# EAGLE design Smart Garden (EAGLE 9.5.1)
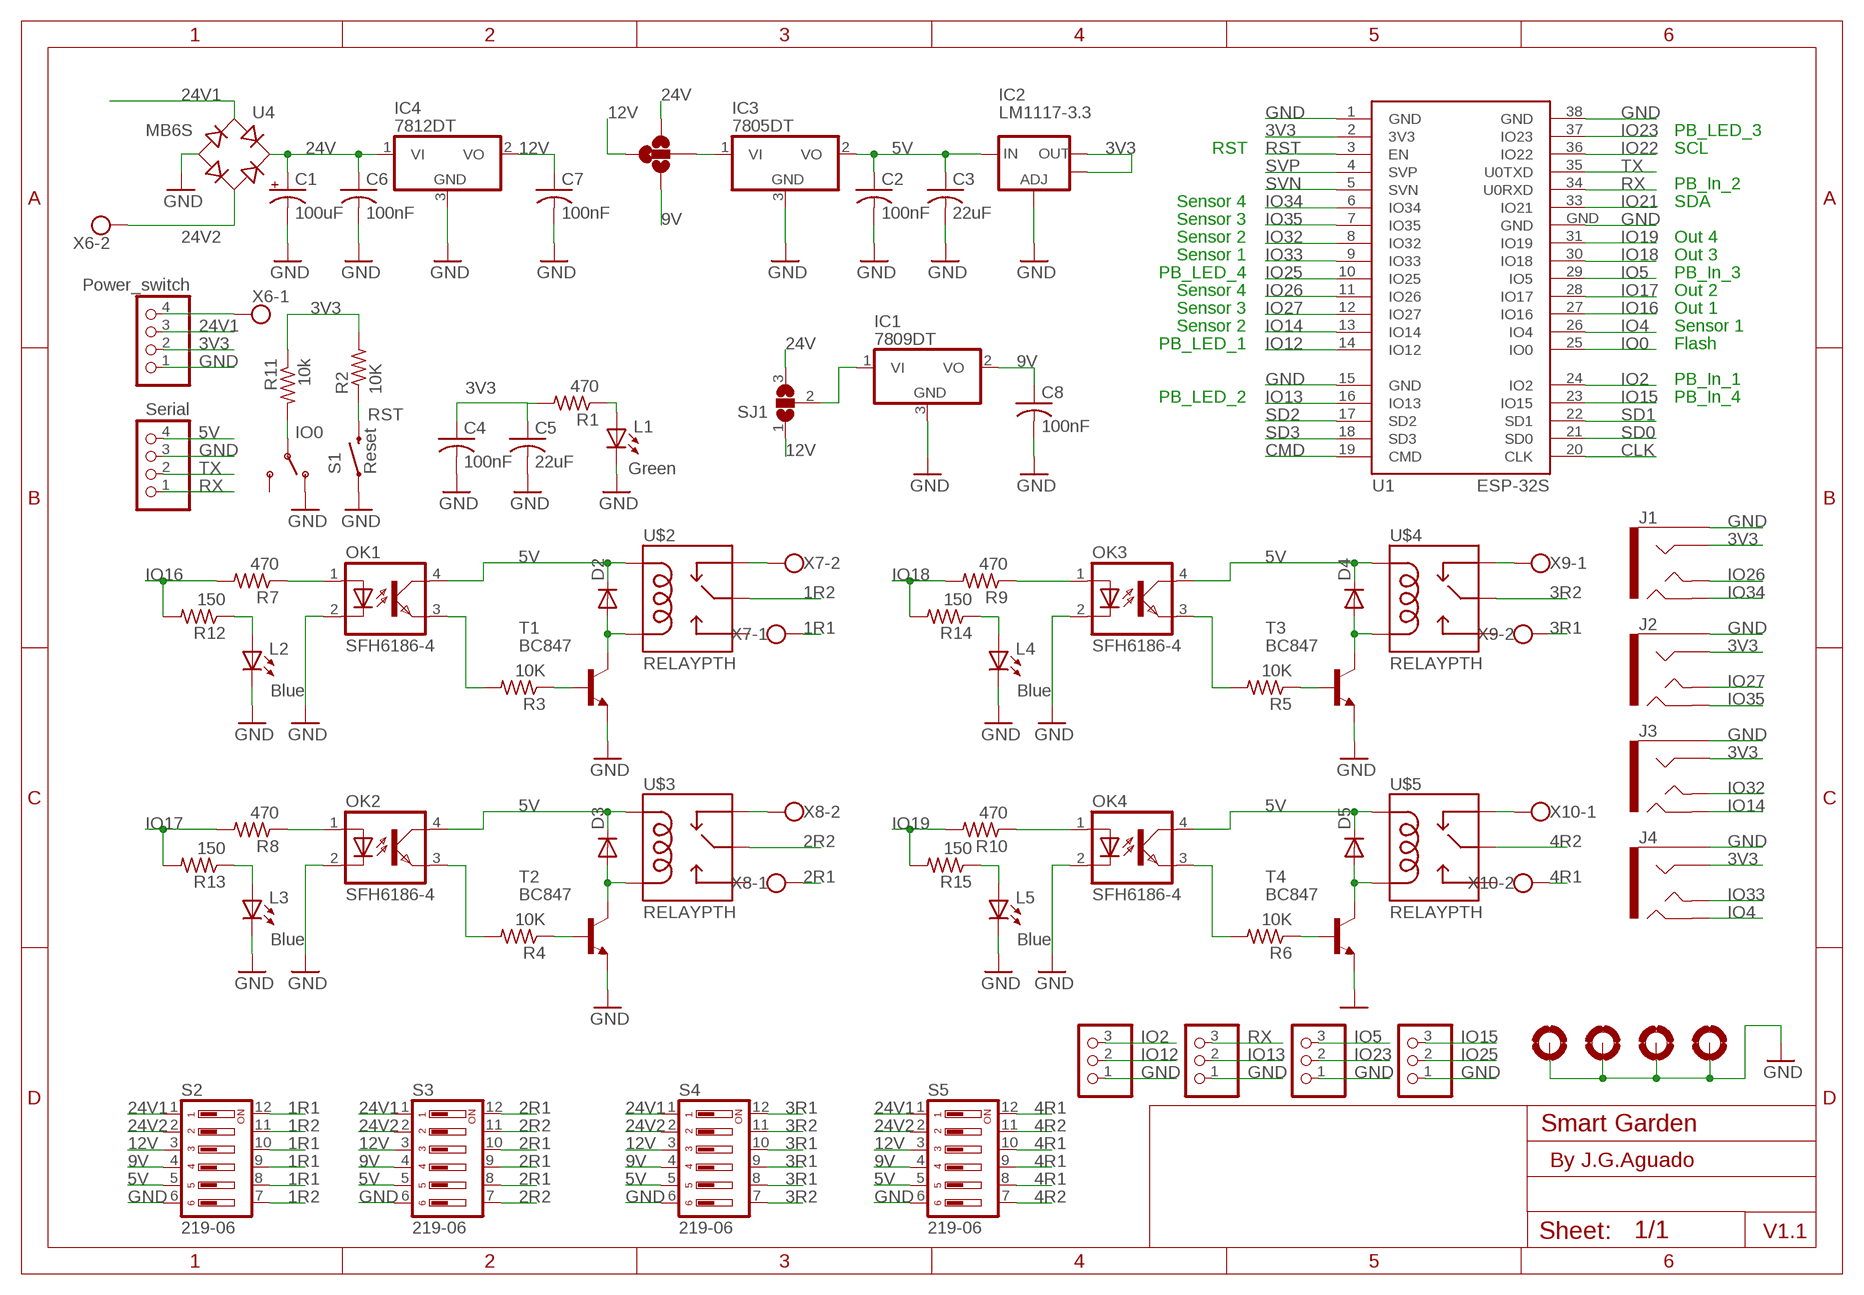
[diagram p0: schematic, sheet 1]

## Parts
C1  100uF  CPOL-USD/7343-31R  [D/7343-31R]
C2  100nF  C1206  [1206]
C3  22uF  C1206  [1206]
C4  100nF  C1206  [1206]
C5  22uF  C1206  [1206]
C6  100nF  C1206  [1206]
C7  100nF  C1206  [1206]
C8  100nF  C1206  [1206]
D2  DIODE-SOD123  [SOD123]
D3  DIODE-SOD123  [SOD123]
D4  DIODE-SOD123  [SOD123]
D5  DIODE-SOD123  [SOD123]
H1  MOUNT-PAD-ROUND3.0  [3,0-PAD]
H2  MOUNT-PAD-ROUND3.0  [3,0-PAD]
H3  MOUNT-PAD-ROUND3.0  [3,0-PAD]
H4  MOUNT-PAD-ROUND3.0  [3,0-PAD]
IC1  7809DT  7805DT  [TO252]
IC2  LM1117-3.3  V_REG_LM1117SOT223  [SOT223]
IC3  7805DT  [TO252]
IC4  7812DT  [TO252]
J1  AUDIO_JACK_TRRSSMD_RA  [AUDIO_JACK_3.5MM_TRRS_SMD_RA]
J2  AUDIO_JACK_TRRSSMD_RA  [AUDIO_JACK_3.5MM_TRRS_SMD_RA]
J3  AUDIO_JACK_TRRSSMD_RA  [AUDIO_JACK_3.5MM_TRRS_SMD_RA]
J4  AUDIO_JACK_TRRSSMD_RA  [AUDIO_JACK_3.5MM_TRRS_SMD_RA]
JP1  Serial  PINHD-1X4  [1X04]
JP2  PINHD-1X3  [1X03]
JP3  PINHD-1X3  [1X03]
JP4  PINHD-1X3  [1X03]
JP5  PINHD-1X3  [1X03]
JP6  Power_switch  PINHD-1X4  [1X04]
L1  Green  LED1206  [LED1206]
L2  Blue  LED1206  [LED1206]
L3  Blue  LED1206  [LED1206]
L4  Blue  LED1206  [LED1206]
L5  Blue  LED1206  [LED1206]
OK1  SFH6186-4  [SMD4-7]
OK2  SFH6186-4  [SMD4-7]
OK3  SFH6186-4  [SMD4-7]
OK4  SFH6186-4  [SMD4-7]
R1  470  R1206  [1206]
R2  10K  R-US_R1206  [R1206]
R3  10K  R-US_R1206  [R1206]
R4  10K  R-US_R1206  [R1206]
R5  10K  R-US_R1206  [R1206]
R6  10K  R-US_R1206  [R1206]
R7  470  R-US_R1206  [R1206]
R8  470  R-US_R1206  [R1206]
R9  470  R-US_R1206  [R1206]
R10  470  R-US_R1206  [R1206]
R11  10k  R1206  [1206]
R12  150  R1206  [1206]
R13  150  R1206  [1206]
R14  150  R1206  [1206]
R15  150  R1206  [1206]
S1  Reset  SWITCH-MOMENTARY-2SMD-4  [TACTILE_SWITCH_TALL]
S2  219-06  [CTS-219-06]
S3  219-06  [CTS-219-06]
S4  219-06  [CTS-219-06]
S5  219-06  [CTS-219-06]
SJ1  SJ2W  [SJ_2]
SJ2  SJ3W  [SJ_3_R]
T1  BC847  [SOT23]
T2  BC847  [SOT23]
T3  BC847  [SOT23]
T4  BC847  [SOT23]
U1  ESP-32S  [ESP-32S]
U4  MB6S  [SOIC-4]
U$2  RELAYPTH  [SRD-05VDC-SL-C]
U$3  RELAYPTH  [SRD-05VDC-SL-C]
U$4  RELAYPTH  [SRD-05VDC-SL-C]
U$5  RELAYPTH  [SRD-05VDC-SL-C]
U$6  SWITCH_SPDT  [KPS-1290]
X6  W237-102  [W237-102]
X7  W237-102  [W237-102]
X8  W237-102  [W237-102]
X9  W237-102  [W237-102]
X10  W237-102  [W237-102]

## Nets
1R1: S2.8 S2.9 S2.10 S2.12 X7.1
1R2: S2.7 S2.11 U$2.SWCOMMON
2R1: S3.8 S3.9 S3.10 S3.12 X8.1
2R2: S3.7 S3.11 U$3.SWCOMMON
3R1: S4.8 S4.9 S4.10 S4.12 X9.2
3R2: S4.7 S4.11 U$4.SWCOMMON
3V3: C4.1 C5.1 IC2.2(OUT) IC2.4(OUT) J1.RING1 J2.RING1 J3.RING1 J4.RING1 JP6.2 R1.2 R2.2 R11.1 U1.2(3V3)
4R1: S5.8 S5.9 S5.10 S5.12 X10.2
4R2: S5.7 S5.11 U$5.SWCOMMON
5V: C2.1 C3.1 D2.C D3.C D4.C D5.C IC2.3(IN) IC3.2(VO) JP1.4 OK1.4(COL) OK2.4(COL) OK3.4(COL) OK4.4(COL) S2.5 S3.5 S4.5 S5.5 U$2.COIL1 U$3.COIL1 U$4.COIL1 U$5.COIL1
9V: C8.1 IC1.2(VO) S2.4 S3.4 S4.4 S5.4 SJ2.P$2
12V: C7.1 IC4.2(VO) S2.3 S3.3 S4.3 S5.3 SJ1.1 SJ2.P$4
24V: C1.+ C6.1 IC4.1(VI) SJ1.3 SJ2.P$3 U4.+
24V1: JP6.3 S2.1 S3.1 S4.1 S5.1 U4.~1(AC1)
24V2: S2.2 S3.2 S4.2 S5.2 U4.~2(AC2) X6.2
CLK: U1.20(CLK)
CMD: U1.19(CMD)
GND: C1.- C2.2 C3.2 C4.2 C5.2 C6.2 C7.2 C8.2 H1.B3,0(MOUNT) H2.B3,0(MOUNT) H3.B3,0(MOUNT) H4.B3,0(MOUNT) IC1.3(GND) IC2.1(ADJ) IC3.3(GND) IC4.3(GND) J1.EARTH J2.EARTH J3.EARTH J4.EARTH JP1.3 JP2.1 JP3.1 JP4.1 JP5.1 JP6.1 L1.C L2.C L3.C L4.C L5.C OK1.2(C) OK2.2(C) OK3.2(C) OK4.2(C) S1.A2 S2.6 S3.6 S4.6 S5.6 T1.2(E) T2.2(E) T3.2(E) T4.2(E) U1.1(GND) U1.15(GND) U1.38(GND) U1.GND U4.- U$6.O
IO0: R11.2 U1.25(IO0) U$6.P
IO2: JP2.3 U1.24(IO2)
IO4: J4.RING2 U1.26(IO4)
IO5: JP4.3 U1.29(IO5)
IO12: JP2.2 U1.14(IO12)
IO13: JP3.2 U1.16(IO13)
IO14: J3.RING2 U1.13(IO14)
IO15: JP5.3 U1.23(IO15)
IO16: R7.2 R12.2 U1.27(IO16)
IO17: R8.2 R13.2 U1.28(IO17)
IO18: R9.2 R14.2 U1.30(IO18)
IO19: R10.2 R15.2 U1.31(IO19)
IO21: U1.33(IO21)
IO22: U1.36(IO22)
IO23: JP4.2 U1.37(IO23)
IO25: JP5.2 U1.10(IO25)
IO26: J1.TIP U1.11(IO26)
IO27: J2.TIP U1.12(IO27)
IO32: J3.TIP U1.8(IO32)
IO33: J4.TIP U1.9(IO33)
IO34: J1.RING2 U1.6(IO34)
IO35: J2.RING2 U1.7(IO35)
N$1: U$3.SWCLOSED(SWCLOSE) X8.2
N$2: U$2.SWCLOSED(SWCLOSE) X7.2
N$3: L1.A R1.1
N$4: U$4.SWCLOSED(SWCLOSE) X9.1
N$5: U$5.SWCLOSED(SWCLOSE) X10.1
N$6: JP6.4 X6.1
N$7: D2.A T1.3(C) U$2.COIL0
N$8: OK1.3(EMIT) R3.2
N$9: R3.1 T1.1(B)
N$11: D3.A T2.3(C) U$3.COIL0
N$12: OK2.3(EMIT) R4.2
N$13: R4.1 T2.1(B)
N$15: D4.A T3.3(C) U$4.COIL0
N$16: OK3.3(EMIT) R5.2
N$17: R5.1 T3.1(B)
N$19: D5.A T4.3(C) U$5.COIL0
N$20: OK4.3(EMIT) R6.2
N$21: R6.1 T4.1(B)
N$22: OK1.1(A) R7.1
N$23: L2.A R12.1
N$24: L3.A R13.1
N$25: OK2.1(A) R8.1
N$26: L4.A R14.1
N$27: OK3.1(A) R9.1
N$28: L5.A R15.1
N$29: OK4.1(A) R10.1
N$30: IC1.1(VI) SJ1.2
N$32: IC3.1(VI) SJ2.P$1
RST: R2.1 S1.B2 U1.3(EN)
RX: JP1.1 JP3.3 U1.34(U0RXD)
SD0: U1.21(SD0)
SD1: U1.22(SD1)
SD2: U1.17(SD2)
SD3: U1.18(SD3)
SVN: U1.5(SVN)
SVP: U1.4(SVP)
TX: JP1.2 U1.35(U0TXD)
Unconnected: U$2.SWOPEN U$3.SWOPEN U$4.SWOPEN U$5.SWOPEN U$6.S

## Notes on the sheet
- PB_LED_3
- RST | SCL
- PB_In_2
- Sensor 4 | SDA
- Sensor 3
- Sensor 2 | Out 4
- Sensor 1 | Out 3
- PB_LED_4 | PB_In_3
- Sensor 4 | Out 2
- Sensor 3 | Out 1
- Sensor 2 | Sensor 1
- PB_LED_1 | Flash
- PB_In_1
- PB_LED_2 | PB_In_4
- By J.G.Aguado
- V1.1

## Library data of the parts
C1 = rcl:CPOL-US: POLARIZED CAPACITOR, American symbol; SPICEPREFIX: C
C2-C8 = SpaceDIY_passive_components:C1206
D2-D5 = diode:DIODE-: DIODE
H1-H4 = holes:MOUNT-PAD-ROUND: MOUNTING PAD, round
IC1 IC3 = linear:78*: Positive VOLTAGE REGULATOR Source: http://cache.national.com/ds/LM/LM78L05.pdf http://www.fairchildsemi.com/ds/LM/LM7805.pdf
IC2 = SparkFun:V_REG_LM1117: Voltage Regulator LM1117 Standard adjustable voltage regulator but in SMD form. Spark Fun Electronics SKU : COM-00595
IC4 = adafruit:78*: Positive VOLTAGE REGULATOR Added bigger pads to the TO-92 package
J1-J4 = SparkFun-Connectors:AUDIO_JACK_TRRS: Audio Jack - 3.5mm TRRS (SMD) This is a 3.5mm TRRS SMD audio jack. TRRS connectors are the audio-style connectors that you see on some phones, MP3 players and development boards. TRRS stands for “tip, ring, ring, sleeve,” which reflects that this has three conductors and a ground. SparkFun Products: Audio Jack <https://www.sparkfun.com/products/12639> mbed Starter Kit <https://www.sparkfun.com/products/12968> SparkFun TRRS 3.5mm Jack Breakout <https://www.sparkfun.com/products/11570>; PROD_ID: CONN-10676; SF_ID: PRT-12639
JP1 JP6 = SpaceDIY_connectors:PINHD-1X4: PIN HEADER
JP2-JP5 = adafruit:PINHD-1X3: PIN HEADER
L1-L5 = SpaceDIY_passive_components:LED1206
OK1-OK4 = optocoupler:SFH618?*: Optocoupler, Phototransistor Output, Low Input Current Source: Data sheet <http://www.vishay.com/docs/83673/sfh618.pdf>; MF: VISHAY/TELEFUNKEN; MPN: SFH6186-4; OC_FARNELL: 1469530; OC_NEWARK: 21H7753
R1 R11-R15 = SpaceDIY_passive_components:R1206
R2-R10 = resistor:R-US_: RESISTOR, American symbol
S1 = Testing:SWITCH-MOMENTARY-2: Various NO switches- pushbuttons, reed, etc
S2-S5 = switch-dil:219-06*: Surface Mount DIP Switch Series 219 SMT CTS Electronic Components Sourc: www.ctscorp.com; OC_FARNELL: unknown; OC_NEWARK: unknown
SJ1 = jumper:SJ2W: SMD solder JUMPER
SJ2 = SpaceDIY_connectors:SJ3W: SMD solder JUMPER
T1-T4 = transistor:BC847: NPN TRANSISTOR
U1 = esp32:ESP-32S: Ai-Thinker ESP-32S
U4 = rectifier:MB*S: Bridge Rectifier Source: http://www.fairchildsemi.com/ds/MB/MB6S.pdf
U$2-U$5 = SpaceDIY_actuators:RELAY: SPDT relay (COM-00101)
U$6 = SparkFun-Retired:SWITCH_SPDT: SWCH-10651 Side-actuated SPDT slide switch, as used on the Arduino Pro; PROD_ID: SWCH-10651
X6-X10 = con-wago-500:W237-102: WAGO SCREW CLAMP; MPN: 237-102; OC_FARNELL: unknown; OC_NEWARK: 70K9898

## Board
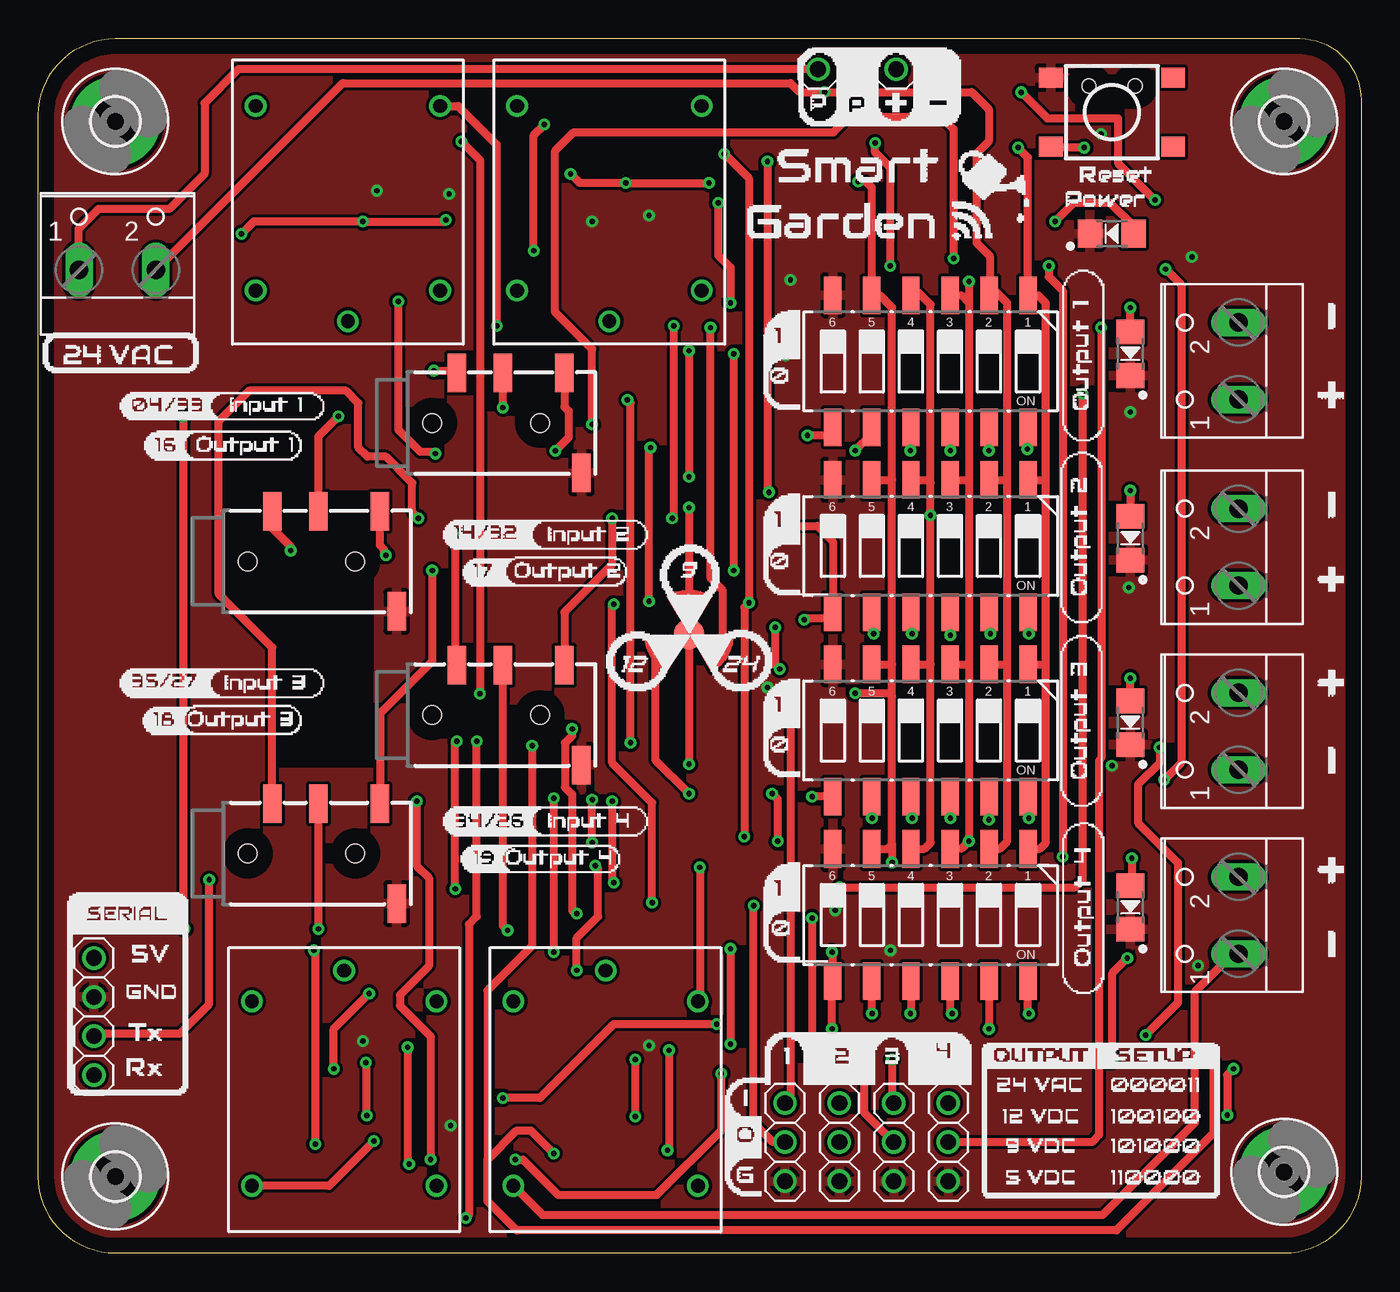
[diagram p1: board, top side]
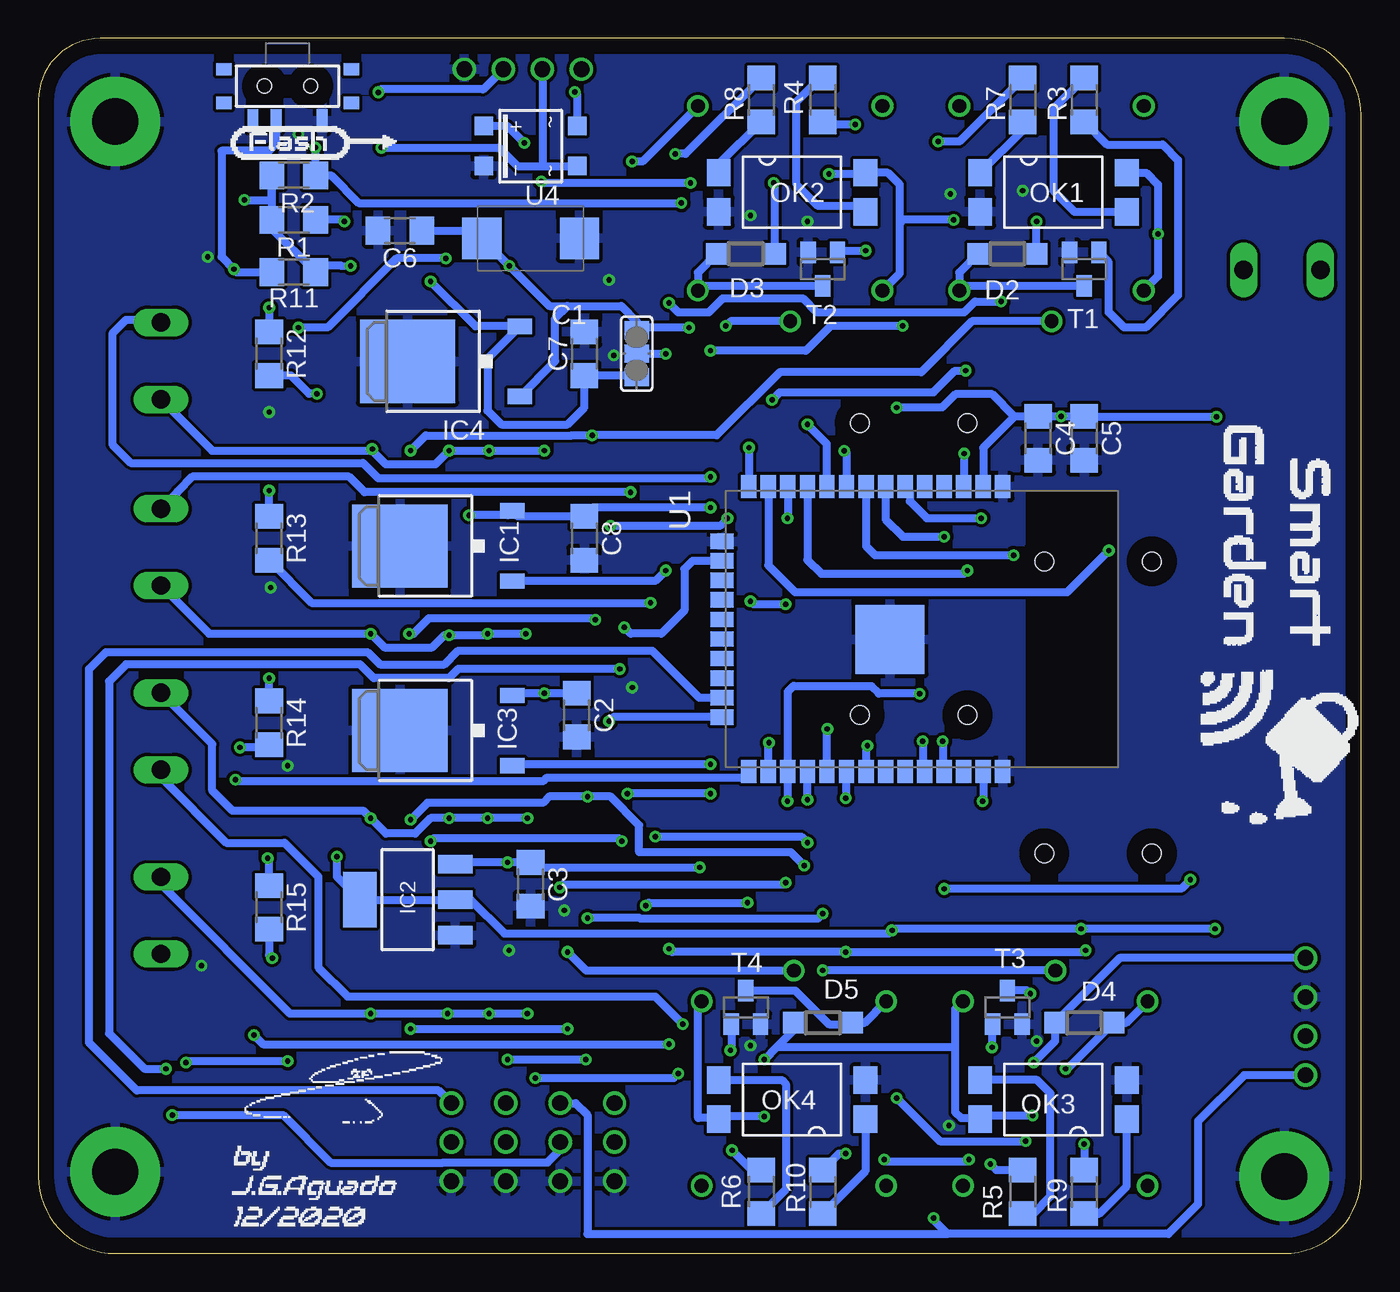
[diagram p2: board, bottom side, seen from below]

Size 86 x 79 mm. Coordinates in mm from the lower left corner, seen from the top.
Outline: 0,5 0,74 arc-90 5,79 82,79 arc-90 86,75 86,5 arc-90 81,0 5,0 arc-90 0,5
Copper layers (1*16): Top 0.035mm / dielectric 1.5mm / Bottom 0.035mm
Design rules "PCBway": minimum track width 6mil, minimum drill 0.3mm, track to track 0.205mm, track to pad 0.205mm, pad to pad 0.205mm, via to via 0.205mm, smd to smd 8mil, copper to edge 40mil, drill to drill 8mil, minimum pad ring 10mil, minimum via ring 8mil, stop-mask expansion 4mil, vias tented up to drill 25mil, thermal gap 10mil

### Footprints (pad centres in the part's own frame; a part is rotated, then mirrored left to right if it is on the bottom)
D/7343-31R = smd 2.55 x 2.7: + 3.175,0; - -3.175,0
1206 = smd 1.6 x 1.803: 1 -1.422,0; 2 1.422,0
SOD123 = smd 1.4 x 1.4: A 1.9,0; C -1.9,0
3,0-PAD = drill 3 pad 5.842: B3,0 0,0
TO252 = smd 1 x 1.6: 1 -2.28,-4.8; 2 2.28,-4.8 | smd 5.4 x 6.2: 3 0,2.5
SOT223 = smd 1.219 x 2.235: 1 -2.311,-3.099; 2 0,-3.099; 3 2.311,-3.099 | smd 3.6 x 2.2: 4 0,3.099
AUDIO_JACK_3.5MM_TRRS_SMD_RA = smd 1.2 x 2.5: EARTH 11.3,-3.25; RING1 6.2,3.25; RING2 3.2,3.25; TIP 10.2,3.25 | hole 1.2: 1.6,0; 8.6,0
1X04 = drill 1.016: 1 -3.81,0; 2 -1.27,0; 3 1.27,0; 4 3.81,0
1X03 = drill 1.016: 1 -2.54,0; 2 0,0; 3 2.54,0
LED1206 = smd 1.6 x 1.803: A -1.422,0; C 1.422,0
SMD4-7 = smd 1.78 x 1.55: 1 -1.27,-4.77; 2 1.27,-4.77; 3 1.27,4.77; 4 -1.27,4.77
R1206 = smd 1.6 x 1.803: 1 -1.422,0; 2 1.422,0
TACTILE_SWITCH_TALL = smd 1.55 x 1.3: A1 -3.975,-2.25; A2 3.975,-2.25; B1 -3.975,2.25; B2 3.975,2.25
CTS-219-06 = smd 1.13 x 2.44: 1 -6.35,-4.3; 2 -3.81,-4.3; 3 -1.27,-4.3; 4 1.27,-4.3; 5 3.81,-4.3; 6 6.35,-4.3; 7 6.35,4.3; 8 3.81,4.3; 9 1.27,4.3; 10 -1.27,4.3; 11 -3.81,4.3; 12 -6.35,4.3
SJ_2 = smd 1.168 x 1.6: 1 -1.524,0; 2 0,0; 3 1.524,0
SJ_3_R = smd 2 x 2: P$1 0,0 | smd 0.254 x 0.254: P$2 0,2.54; P$3 2.2,-1.27; P$4 -2.2,-1.27
SOT23 = smd 1 x 1.4: 1 -0.95,-1.1; 2 0.95,-1.1; 3 0,1.1
ESP-32S = smd 1.5 x 1: 1 -9.25,7; 2 -9.25,5.73; 3 -9.25,4.46; 4 -9.25,3.19; 5 -9.25,1.92; 6 -9.25,0.65; 7 -9.25,-0.62; 8 -9.25,-1.89; 9 -9.25,-3.16; 10 -9.25,-4.43; 11 -9.25,-5.7; 12 -9.25,-6.97; 13 -9.25,-8.24; 14 -9.25,-9.51; 25 9.25,-9.51; 26 9.25,-8.24; 27 9.25,-6.97; 28 9.25,-5.7; 29 9.25,-4.43; 30 9.25,-3.16; 31 9.25,-1.89; 32 9.25,-0.62; 33 9.25,0.65; 34 9.25,1.92; 35 9.25,3.19; 36 9.25,4.46; 37 9.25,5.73; 38 9.25,7 | smd 1 x 1.5: 15 -5.7,-11.25; 16 -4.43,-11.25; 17 -3.16,-11.25; 18 -1.89,-11.25; 19 -0.62,-11.25; 20 0.65,-11.25; 21 1.92,-11.25; 22 3.19,-11.25; 23 4.46,-11.25; 24 5.73,-11.25 | smd 4.5 x 4.5: GND 0.68,-0.33
SOIC-4 = smd 1.2 x 1.2: + 1.3,3.05; - -1.3,3.05; ~1 -1.3,-3.05; ~2 1.3,-3.05
SRD-05VDC-SL-C = drill 0.9: COIL0 -5.39,-6.12; COIL1 -5.39,5.88; SWCLOSED 6.61,-6.12; SWCOMMON -7.39,-0.12; SWOPEN 6.61,5.88
KPS-1290 = smd 0.7 x 1.5: O -2.25,2.25; P 0.75,2.25; S 2.25,2.25 | smd 1 x 0.8: P$1 -4.15,1.1; P$2 -4.15,-1.1; P$3 4.15,-1.1; P$4 4.15,1.1 | hole 0.9: -1.5,0; 1.5,0
W237-102 = drill 1.194 long: 1 -2.5,-1.27; 2 2.5,-1.27

### Placement (x,y rotation side)
C1  54,66 180 bottom
C2  51,35 270 bottom
C3  54,24 270 bottom
C4  21,53 270 bottom
C5  18,53 270 bottom
C6  62.5,66.5 180 bottom
C7  50.5,58.5 90 bottom
C8  50.5,46.5 270 bottom
D2  23,65 180 bottom
D3  40,65 180 bottom
D4  18,15 0 bottom
D5  35,15 0 bottom
H1  5,5 0 top
H2  81,5.3 0 top
H3  5,73.6 0 top
H4  81,73.6 0 top
IC1  60,46 90 bottom
IC2  62,23 90 bottom
IC3  60,34 90 bottom
IC4  59.5,58 90 bottom
J1  12,26 0 top
J2  24,35 0 top
J3  12,45 0 top
J4  24,54 0 top
JP1  3.6,15.4 90 top
JP2  48.54,7.23 90 top
JP3  52.08,7.23 90 top
JP4  55.62,7.23 90 top
JP5  59.16,7.23 90 top
JP6  54.5,77 180 top
L1  69.8,66.3 180 top
L2  71,58.5 270 top
L3  71,46.5 270 top
L4  71,34.5 270 top
L5  71,22.5 270 top
OK1  20,69 270 bottom
OK2  37,69 270 bottom
OK3  20,10 90 bottom
OK4  37,10 90 bottom
R1  69.4,67.2 180 bottom
R2  69.4,70.1 180 bottom
R3  18,75 90 bottom
R4  35,75 90 bottom
R5  22,4 270 bottom
R6  39,4 270 bottom
R7  22,75 90 bottom
R8  39,75 90 bottom
R9  18,4 90 bottom
R10  35,4 90 bottom
R11  69.4,63.8 180 bottom
R12  71,58.5 270 bottom
R13  71,46.5 270 bottom
R14  71,34.5 270 bottom
R15  71,22.5 270 bottom
S1  69.8,74.2 180 top
S2  58,58 180 top
S3  58,46 180 top
S4  58,34 180 top
S5  58,22 180 top
SJ1  47.1,58.5 90 bottom
SJ2  42.3,40.26 0 top
T1  18,64 180 bottom
T2  35,64 180 bottom
T3  23,16 0 bottom
T4  40,16 0 bottom
U1  30.3,40.6 270 bottom
U4  54,72 90 bottom
U$2  20,68 90 top
U$3  37,68 90 top
U$4  20,11 270 top
U$5  37,11 270 top
U$6  69.8,75.9 180 bottom
X6  5.14,65.22 0 top
X7  76.76,58.03 90 top
X8  76.76,45.92 90 top
X9  76.76,33.95 90 top
X10  76.76,21.98 90 top

### Tracks (layer width: path | path; a pad name or v marks a point on that pad's centre or on a via)
1R1  (via drill 0.35)
  Top 0.508: v53.1,52.2 54.19,53.29 S2.8 | S2.9 56.73,52.23 v56.7,52.2 | S2.10 59.3,53.67 v59.3,52.2 | v64.3,52.3 64.3,53.65 S2.12
  Bottom 0.508: X7.1 74.7,52.2 64.3,52.2 | v53.1,52.2 v56.7,52.2 v59.3,52.2 60.2,51.3 63.4,51.3 64.3,52.2 | 64.3,52.2 v64.3,52.3
1R2  (via drill 0.35)
  Top 0.508: S2.11 v61.81,52.21 v61.8,52.2 | v50,53.2 51.15,53.2 S2.7
  Bottom 0.508: v61.8,52.2 60.81,53.19 51.3,53.19 51.29,53.2 v50,53.2 41.9,53.2 37.8,57.3 28.6,57.3 25.29,60.61 U$2.SWCOMMON
2R1  (via drill 0.35)
  Top 0.508: S3.12 64.35,40.35 v64.4,40.3 | v54.3,40.3 54.19,40.41 S3.8 | S3.9 56.73,40.37 v56.8,40.3 | S3.10 59.27,40.23 v59.3,40.2
  Bottom 0.508: v54.3,40.3 v56.8,40.3 56.9,40.2 v59.3,40.2 59.6,40.2 60.4,39.4 63.5,39.4 v64.4,40.3 74.91,40.3 X8.1
2R2  (via drill 0.35)
  Top 0.508: v41.3,60.3 41.3,47.9 v41.2,47.8 | v48.8,47.3 50.65,47.3 51.65,46.3 S3.7 51.65,41.65 51.3,41.3 49.9,41.3 v49.8,41.2 | S3.11 61.81,40.39 v61.9,40.3
  Bottom 0.508: U$3.SWCOMMON 40.99,60.61 v41.3,60.3 | v41.2,47.8 41.7,47.3 v48.8,47.3 | v61.9,40.3 61.6,40.3 60.6,41.3 49.9,41.3 v49.8,41.2
3R1  (via drill 0.35)
  Top 0.508: S4.8 v54.19,28.31 v54.2,28.3 | v64.4,28.3 64.4,29.65 S4.12 | S4.9 56.73,28.37 v56.8,28.3 | S4.10 59.27,28.33 v59.3,28.3
  Bottom 0.508: v54.2,28.3 v56.8,28.3 v59.3,28.3 60.5,28.3 61.5,27.3 63.4,27.3 v64.4,28.3 64.9,28.8 73.4,28.8 74.7,30.1 74.7,33.12 X9.2
3R2  (via drill 0.35)
  Top 0.508: S4.7 v50.3,29.7 | v61.8,28.2 S4.11 | v35,18.4 35,20.5 36.4,21.9 36.4,25 v36.2,25.2
  Bottom 0.508: v61.8,28.2 60.7,29.3 53.2,29.3 52.8,29.7 v50.3,29.7 48.8,29.7 46.94,27.84 46.94,26.1 37.1,26.1 v36.2,25.2 | U$4.SWCOMMON v34.99,18.39 v35,18.4
3V3  (via drill 0.35)
  Top 0.508: v65.7,64.2 65.7,63.5 66.6,62.6 v66.6,25.8 | v30.5,21 30.2,21.3 J2.RING1 | v30.2,55 J4.RING1 | v19.5,54.42 18.2,53.12 J3.RING1 | J1.RING1 v18.2,21.1 | v9.4,54.4 9.4,21.2 v9.5,21.1 | v63.9,75.5 65.6,73.8 67.7,73.8 70.2,73.8 70.2,73.3 70.2,70.9 v72.6,68.5
  Bottom 0.508: JP6.2 57.1,75.67 57.1,75.7 63.7,75.7 v63.9,75.5 | v65.7,64.2 66.29,64.21 68.39,64.21 R11.1 70.82,66.64 R1.2 R2.2 70.82,68.58 70.9,68.5 v72.6,68.5 | v66.6,25.8 66.6,24.5 IC2.4 IC2.2 57.9,23 55.7,20.8 30.7,20.8 v30.5,21 30.4,21.1 v18.2,21.1 v9.5,21.1 | 22.53,54.42 C4.1 v19.5,54.42 C5.1 9.42,54.42 v9.4,54.4 | U1.2 24.57,52.38 22.53,54.42 | v30.2,55 27.25,55 26.38,55.87 23.98,55.87 22.53,54.42
4R1  (via drill 0.35)
  Top 0.508: v64.4,15.6 64.35,15.65 S5.12 | v54.2,15.6 S5.8 | S5.9 56.73,15.63 v56.7,15.6 | S5.10 59.27,15.73 v59.4,15.6
  Bottom 0.508: X10.2 78.03,23.98 69.66,15.6 v64.4,15.6 v59.4,15.6 v56.7,15.6 v54.2,15.6
4R2  (via drill 0.35)
  Top 0.508: S5.11 v61.81,14.61 v61.8,14.6 | v51.6,14.6 51.6,17.65 S5.7 51.65,19.55 v51.6,19.6
  Bottom 0.508: v61.8,14.6 v51.6,14.6 | v51.6,19.6 50.39,18.39 U$5.SWCOMMON
5V  (via drill 0.35)
  Top 0.508: S5.5 55.2,26.3 55.5,26.6 | 55.5,26.6 55.5,36.2 | 55.5,36.2 55.5,38.3 | 55.5,38.3 55.5,50.3 | 55.5,50.3 55.5,61.5 54.7,62.3 S2.5 54.19,69.31 53.8,69.7 v53.3,69.7 | S3.5 55.5,50.3 | S4.5 55.5,38.3 | v34.6,70.2 35.2,69.6 v38.2,69.6 v43.6,69.6 | v13.2,66.3 14,67.1 v21.1,67.1 26.4,67.1 v26.5,67.2 | 55.5,26.6 v55.5,25.42 | v38.8,12.6 v38.8,8.9 | v21.3,12.4 21.3,9.1 21.4,9 v21.35,8.95 | v43,25.1 43,16.51 U$5.COIL1 | 55.5,36.2 55.28,36.42 v53.1,36.42
  Bottom 0.508: D3.C 38.1,69.5 v38.2,69.6 | v34.6,70.2 32.3,70.2 OK2.4 30.77,70.27 30,69.5 30,67 | U$3.COIL1 30,63.73 30,67 | OK1.4 13.97,70.27 13.2,69.5 v13.2,66.3 13.2,63.53 U$2.COIL1 | D2.C v21.1,67.1 | v26.5,67.2 29.8,67.2 30,67 | v43.6,69.6 53.2,69.6 v53.3,69.7 | IC2.3 58.79,25.42 v55.5,25.42 C3.1 53.68,25.1 v43,25.1 | OK4.4 41.84,8.8 | 41.84,8.8 43.1,8.8 43.1,16.17 U$5.COIL1 | D5.C 36.9,14.5 38,13.4 | v38.8,8.9 41.74,8.9 41.84,8.8 | v21.3,12.4 19.9,13.8 D4.C 15.69,19.21 JP1.4 | v21.35,8.95 24.55,8.95 OK3.4 24.84,8.8 26,8.8 26.4,9.2 26.4,13.4 | U$4.COIL1 26.4,15.87 26.4,13.4 | 26.4,13.4 38,13.4 | 38,13.4 v38.8,12.6 | C2.1 v53.1,36.42 55.06,36.42 IC3.2
9V  (via drill 0.35)
  Top 0.508: S5.4 57.6,26.3 58,26.7 58,38.3 | 58,38.3 v58,48 58,50.1 | 58,50.1 58,61.7 57.2,62.5 56.93,62.5 S2.4 | S4.4 58,38.3 | S3.4 57.8,50.3 58,50.1 | SJ2.P$2 | v42.3,48.5 SJ2.P$2
  Bottom 0.508: v58,48 55.48,48 IC1.2 54.84,47.92 C8.1 49.92,48.5 v42.3,48.5
12V  (via drill 0.35)
  Top 0.508: S2.3 60,62.3 60.5,61.8 | 60.5,61.8 60.5,50.4 | 60.5,50.4 60.5,38.3 | 60.5,38.3 v60.5,26.8 60,26.3 S5.3 | S3.3 60.4,50.3 60.5,50.4 | S4.3 60.5,38.3 | SJ2.P$4 40.1,32.1 v42.3,29.9 | v60.5,63.2 60.5,61.8 | v47.7,29.9 48.06,29.54 v48.06,26.8
  Bottom 0.508: SJ1.1 47.2,57.08 C7.1 50.5,55 51.6,53.9 55.9,53.9 56.8,54.8 56.8,58.18 IC4.2 57.58,60.28 v60.5,63.2 | v42.3,29.9 v47.7,29.9 | v48.06,26.8 48.26,27 60.3,27 v60.5,26.8
24V  (via drill 0.35)
  Top 0.508: SJ2.P$3 44.5,43.1 43.7,43.9 v43.7,60.2 | v55.39,64.21 55.39,70.61 54.4,71.6 v54.4,72.2
  Bottom 0.508: IC4.1 52.4,58.02 52.4,60.8 51.6,61.6 | 51.6,61.6 48.1,61.6 47.1,60.6 47.1,60.1 | 47.1,60.1 SJ1.3 | 51.6,61.6 52.77,61.6 v55.39,64.21 C1.+ 57.04,66.14 57.4,66.5 C6.1 | v43.7,60.2 47,60.2 47.1,60.1 | v54.4,72.2 55.5,73.3 U4.+
24V1  (via drill 0.35)
  Top 0.508: S5.1 65.1,26.3 65.5,26.7 65.5,38.3 | 65.5,38.3 65.5,50.2 | 65.5,50.2 65.5,61.8 65,62.3 S2.1 64.35,71.25 v63.7,71.9 | S3.1 65.4,50.3 65.5,50.2 | S4.1 65.5,38.3
  Bottom 0.508: v63.7,71.9 56.05,71.9 54.85,70.7 53.3,70.7 | 53.3,70.7 U4.~1 | JP6.3 53.23,70.77 53.3,70.7
24V2  (via drill 0.35)
  Top 0.508: S5.2 62.5,26.3 63,26.8 63,38.3 | 63,38.3 63,50.3 | 63,50.3 63,61.8 62.3,62.5 62.01,62.5 61.85,62.34 | 61.85,62.34 S2.2 | X6.2 19.79,76.1 48.9,76.1 49.49,75.51 v51.13,75.51 60.69,75.51 61.8,74.4 61.8,72.32 60.99,71.51 60.99,65.71 61.85,64.85 61.85,62.34 | S4.2 63,38.3 | S3.2 63,50.3
  Bottom 0.508: v51.13,75.51 50.95,75.34 U4.~2
GND  (via drill 0.35)
  Top 0.508: L5.C 71.5,20.58
  other vias: 21.1,13.8 26.8,8.3 39.7,13.5 51.8,22.3 55.4,19.7 47.4,36.8 69.8,31.7 70.9,43.3 71,54.7 75,64.8 48.9,63.3 39.7,67.5 36,67.1 26.7,68.9 22,69.1 48.6,58.4 75.4,18.7 69.1,72.8
  pour Top: 0,74 arc-90 5,79 81,79 arc-90 86,74 86,5 arc-90 81,0 5,0 arc-90 0,5
  pour Bottom: 0,74 arc-90 5,79 81,79 arc-90 86,74 86,5 arc-90 81,0 5,0 arc-90 0,5
IO0  (via drill 0.35)
  Top 0.508: v73.2,30.8 74.3,31.9 74.3,63 v73.3,64
  Bottom 0.508: R11.2 73.1,63.8 v73.3,64 74.1,64.8 74.1,71.7 71,71.7 70.55,72.15 U$6.P | U1.25 40.26,30.9 53,30.9 53.2,30.7 73.1,30.7 v73.2,30.8
IO2  (via drill 0.35)
  Top 0.508: v48.9,34.6 48.9,10.13 JP2.3
  Bottom 0.508: U1.24 48.63,34.87 v48.9,34.6
IO4  (via drill 0.35)
  Top 0.508: v38.5,33.2 38.5,55.3 v38.3,55.5 | v25.7,57.4 27.05,57.4 J4.RING2
  Bottom 0.508: U1.26 38.54,33.16 v38.5,33.2 | v38.3,55.5 37.8,56 27.8,56 26.4,57.4 v25.7,57.4
IO5  (via drill 0.35)
  Top 0.508: v34.7,34.1 34.7,33.65 34.24,33.19 34.24,30.31 34.7,29.85 34.7,22.3 34.9,22.1 v35,22.1 | v50.3,21.8 50.3,12.7 v50.4,12.6 | v55.5,12.6 55.5,9.89 JP4.3
  Bottom 0.508: U1.29 34.73,34.07 v34.7,34.1 | v50.3,21.8 46.88,21.8 46.85,21.76 35.34,21.76 v35,22.1 | v50.4,12.6 v55.5,12.6
IO12  (via drill 0.35)
  Top 0.508: JP2.2 47.77,7.23 46.5,8.5 v46.5,22.6 | v39.9,22.8 39.9,29.3 37.3,31.9 37.3,42.1 v37.4,42.2 | v39.7,42.4 39.7,52.3 v39.8,52.4
  Bottom 0.508: v46.5,22.6 46.3,22.8 v39.9,22.8 | v37.4,42.2 39.5,42.2 v39.7,42.4 | v39.8,52.4 v39.81,52.39 U1.14
IO13  (via drill 0.35)
  Top 0.508: v47.9,40.7 47.9,38.3 v48.2,38 | v77.3,9 77.3,11.6 v77.7,12
  Bottom 0.508: U1.16 43.47,45.03 44,44.5 44,41.8 45.5,40.3 47.5,40.3 v47.9,40.7 | v48.2,38 58.7,38 59.3,37.4 64.2,37.4 65.1,38.3 80.3,38.3 81.4,37.2 81.4,14.3 79.1,12 v77.7,12 | v77.3,9 70.1,9 67,5.9 59.68,5.9 59.67,5.91 52.89,5.91 52.08,6.72 JP3.2
IO14  (via drill 0.35)
  Top 0.508: J3.RING2 15.2,47.15 16.4,45.95 v16.4,45.7
  Bottom 0.508: U1.13 38.54,44.74 36.8,43 19.1,43 v16.4,45.7
IO15
  Bottom 0.508: JP5.3 59.99,10.6 79.6,10.6 82.7,13.7 82.7,38 81.6,39.1 64.6,39.1 63.8,38.3 59.6,38.3 58.7,39.2 46.1,39.2 43.04,36.14 U1.23
IO16  (via drill 0.35)
  Top 0.508: v27.5,72.3 28.7,71.1 v28.7,36.4 | v37.3,29.4 37.3,24.1 v37.4,24.1 | v67.9,55.9 67.9,24.3 67.4,23.8 v52.1,23.8
  Bottom 0.508: R7.2 26.12,72.3 v27.5,72.3 | v28.7,36.4 31.36,36.4 31.82,36.87 36.87,36.87 36.9,36.9 37.27,36.53 U1.27 37.3,31.32 v37.3,29.4 | v67.9,55.9 68.4,55.9 69.58,57.08 R12.2 | v37.4,24.1 37.5,24 51.9,24 v52.1,23.8
IO17  (via drill 0.35)
  Top 0.508: v44.6,71.5 46.2,69.9 v46.2,42.3 45.9,42 v45.9,27.1 | v36,26.7 v36,29.5
  Bottom 0.508: R8.2 43.92,71.5 v44.6,71.5 | R13.2 68.22,42.3 v46.2,42.3 | v36,29.5 U1.28 | v45.9,27.1 36.4,27.1 v36,26.7
IO18  (via drill 0.35)
  Top 0.508: v72.9,32.9 72.9,31.9 71.5,30.5 71.5,28 74.1,25.4 74.1,16.3 v72,14.2 | v33.5,29.6 v33.5,19.6 | v17.9,19.7 18,19.6 v18,7.1 | v45,19.8 v45,13.6
  Bottom 0.508: R14.2 71.18,32.9 v72.9,32.9 | v72,14.2 71.4,13.6 v45,13.6 | U1.30 33.5,31.31 v33.5,29.6 | v17.9,19.7 18,19.6 v33.5,19.6 44.8,19.6 v45,19.8 | v18,7.1 R9.2
IO19  (via drill 0.35)
  Top 0.508: v33.5,6.5 32,8 31.1,8 29.2,6.1 | v76.4,12.4 76.4,7.8 70.1,1.5 31.1,1.5 29.2,3.4 29.2,6.1 | v32.1,33.01 32.1,20 29.2,17.1 29.2,6.1 | v70.8,19.2 69.8,18.2 v69.8,12.5
  Bottom 0.508: R10.2 33.92,6.5 v33.5,6.5 | v32.1,33.01 32.19,32.92 U1.31 | R15.2 71,19.4 v70.8,19.2 | v69.8,12.5 76.3,12.5 v76.4,12.4
IO23  (via drill 0.35)
  Top 0.508: JP4.2 53.7,9.15 v53.7,11.4 | v24.6,29.4 24.6,25.2 25.4,24.4 25.4,18.7 23.5,16.8 23.5,16.1 25.5,14.1 v25.5,6.1 | v31,6.1 31.5,6.1 33.8,3.8 40.2,3.8 44.4,8 v44.4,11.7
  Bottom 0.508: v53.7,11.4 44.7,11.4 v44.4,11.7 | U1.37 24.57,29.43 v24.6,29.4 | v25.5,6.1 25.5,6 30.9,6 v31,6.1
IO25  (via drill 0.35)
  Top 0.508: v36,53.9 36,58.8 33.6,61.2 33.6,71.7 34.8,72.9 51.7,72.9 52.7,73.9 58.7,73.9 59.5,73.1 v59.5,64.7 | JP5.2 68.5,7.23 68.96,7.69 68.96,32.05 69.1,32.18 v69.1,60.2
  Bottom 0.508: U1.10 34.73,52.63 v36,53.9 | v59.5,64.7 62.7,64.7 67.2,60.2 v69.1,60.2
IO26  (via drill 0.35)
  Top 0.508: v25.6,44.4 25.6,38.5 22.2,35.1 J1.TIP
  Bottom 0.508: U1.11 36,45.1 35.1,44.2 25.8,44.2 v25.6,44.4
IO27  (via drill 0.35)
  Top 0.508: v37.3,47.8 37.3,44.8 34.2,41.7 J2.TIP
  Bottom 0.508: U1.12 37.27,47.83 v37.3,47.8
IO32  (via drill 0.35)
  Top 0.508: v22.59,45.4 22.47,45.52 22.47,45.77 22.2,46.05 J3.TIP
  Bottom 0.508: U1.8 32.19,45.99 31.6,45.4 v22.59,45.4
IO33  (via drill 0.35)
  Top 0.508: J4.TIP 34.2,55.05 34.47,54.77 34.47,53.05 v33.61,52.19
  Bottom 0.508: v33.61,52.19 33.46,52.04 U1.9
IO34  (via drill 0.35)
  Top 0.508: J1.RING2 15.2,39.4 11.73,42.87 11.73,45.1 11.7,45.13 11.7,54.1 13.7,56.1 20,56.1 20.8,55.3 20.8,52.4 21.4,51.8 22.6,51.8 24.3,50.1 24.3,48.2 v24.7,47.8
  Bottom 0.508: U1.6 29.34,49.54 29.34,48.91 28.23,47.8 v24.7,47.8
IO35  (via drill 0.35)
  Top 0.508: v27.1,46.6 27.1,38.35 J2.RING2
  Bottom 0.508: U1.7 30.92,47.72 29.8,46.6 v27.1,46.6
N$1  (via drill 0.35)
  Top 0.508: v47.4,71 47.4,49.6 v47.5,49.5
  Bottom 0.508: v47.5,49.5 64.8,49.5 65.8,50.5 76,50.5 76.95,49.55 76.95,49.5 X8.2 | U$3.SWCLOSED 46.73,71 v47.4,71
N$2  (via drill 0.35)
  Top 0.508: U$2.SWCLOSED 27.29,74.61 29.8,72.1 v29.8,60.3 | v42.3,58.7 v42.3,50.5
  Bottom 0.508: v29.8,60.3 34.5,60.3 36.1,58.7 v42.3,58.7 | X7.2 78.2,60.7 80.3,60.7 81.2,59.8 81.2,52.6 80,51.4 64.9,51.4 63.9,50.4 42.4,50.4 v42.3,50.5
N$3  (via drill 0.35)
  Top 0.508: L1.A 71.22,66.78 69.7,68.3 67.3,68.3 v66.1,67.1
  Bottom 0.508: v66.1,67.1 66.2,67.2 R1.1
N$4  (via drill 0.35)
  Top 0.508: v44.1,14.9 37.4,14.9 32.6,10.1 v30.2,10.1 | v21.8,7.3 18.89,4.39 U$4.SWCLOSED
  Bottom 0.508: X9.1 78.03,30.95 73.78,26.7 70,26.7 67.8,24.5 67.8,18.6 65.9,16.7 45.9,16.7 v44.1,14.9 | v30.2,10.1 27.4,7.3 v21.8,7.3
N$5
  Top 0.508: U$5.SWCLOSED 32.77,2.5 69.2,2.5 75.2,8.5 75.2,17 77.68,19.48 X10.1
N$6
  Top 0.508: JP6.4 13,77 10.8,74.8 10.8,70.2 8.5,67.9 3.9,67.9 2.6,66.6 2.6,63.98 X6.1
N$7
  Bottom 0.508: T1.3 25.83,62.9 U$2.COIL0 26.12,63.78 D2.A
N$8
  Bottom 0.508: R3.2 20,74.42 20,69.1 18.63,67.73 OK1.3
N$9
  Bottom 0.508: R3.1 16.52,72.1 12.9,72.1 11.9,71.1 11.9,62.3 14,60.2 15.4,60.2 16.4,61.2 16.4,64.45 T1.1
N$11
  Bottom 0.508: D3.A 43.12,63.78 U$3.COIL0 42.83,62.9 T2.3
N$12
  Bottom 0.508: OK2.3 32.6,68.1 35.3,68.1 36.7,69.5 36.7,74.9 35.18,76.42 R4.2
N$13  (via drill 0.35)
  Top 0.508: v32.2,65.2 32.2,72.7 v32.9,73.4
  Bottom 0.508: T2.1 33.95,65.2 v32.2,65.2 | v32.9,73.4 35.5,73.4 35.32,73.58 R4.1
N$15  (via drill 0.35)
  Top 0.508: v19.2,12 19.2,14.6 v21.5,16.9
  Bottom 0.508: U$4.COIL0 15.27,15 D4.A 19.1,12 v19.2,12 | v21.5,16.9 21.7,17.1 T3.3
N$16
  Bottom 0.508: R5.2 21.32,2.58 20.2,3.7 20.2,10.4 21.07,11.27 OK3.3
N$17  (via drill 0.35)
  Top 0.508: v24,13.4 24,5.9 v24.1,5.8
  Bottom 0.508: T3.1 24,14.85 v24,13.4 | v24.1,5.8 23.72,5.42 R5.1
N$19
  Bottom 0.508: D5.A 32.7,15 | 32.7,15 32.27,15 U$5.COIL0 | T4.3 36.8,17.1 34.6,14.9 32.8,14.9 32.7,15
N$20
  Bottom 0.508: R6.2 37.4,4.18 37.4,11 37.67,11.27 OK4.3
N$21  (via drill 0.35)
  Top 0.508: v41,13.2 41,6.8 v40.9,6.7
  Bottom 0.508: T4.1 40.95,13.25 v41,13.2 | v40.9,6.7 39.62,5.42 R6.1
N$22
  Bottom 0.508: R7.1 22,73.04 OK1.1
N$23  (via drill 0.35)
  Top 0.508: L2.A v71,61.5
  Bottom 0.508: v71,61.5 L2.A
N$24  (via drill 0.35)
  Top 0.508: v71,49.6 L3.A
  Bottom 0.508: L3.A v71,49.6
N$25
  Bottom 0.508: R8.1 41.77,70.81 OK2.1
N$26  (via drill 0.35)
  Top 0.508: L4.A v71,37.4
  Bottom 0.508: L4.A v71,37.4
N$27
  Bottom 0.508: R9.1 17.02,2.58 15.23,4.37 15.23,5 OK3.1
N$28  (via drill 0.35)
  Top 0.508: v71.1,25.7 71.1,24.02 L5.A
  Bottom 0.508: L5.A 71,25.6 v71.1,25.7
N$29
  Bottom 0.508: OK4.1 32.23,5.35 R10.1
N$30  (via drill 0.35)
  Top 0.508: v45.2,58.5 v45.2,44.4
  Bottom 0.508: SJ1.2 v45.2,58.5 | v45.2,44.4 45.88,43.72 IC1.1
N$32  (via drill 0.35)
  Top 0.508: SJ2.P$1 v42.3,31.8 | v42.3,31.8
  Bottom 0.508: v42.3,31.8 55.12,31.8 IC3.1
RST  (via drill 0.35)
  Top 0.508: v44.2,68.3 44.2,64.9 45,64.1 v45,61.8 | v25.8,52.01 25.68,52.13 24.82,52.13 23.4,53.55 v23.4,61.9 | v68,71.9 65.88,71.9 S1.B2
  Bottom 0.508: v44.2,68.3 65.18,68.3 66.98,70.1 R2.1 67.98,71.88 v68,71.9 | v45,61.8 44.4,61.2 42.4,61.2 41.5,62.1 36.3,62.1 35.4,61.2 25.8,61.2 25.1,61.9 v23.4,61.9 | v25.8,52.01 25.84,51.97 U1.3
RX  (via drill 0.35)
  Top 0.508: v27.8,2.3 28,2.5 28,21.4 28.5,21.9 v28.5,33.3
  Bottom 0.508: JP1.1 7.6,11.59 10.6,8.59 10.6,3.2 12.53,1.27 26.9,1.27 | 26.9,1.27 27.8,2.17 v27.8,2.3 | v28.5,33.3 28.5,31.47 U1.34 | JP3.3 51.07,9.77 50.3,9 50.3,1.27 26.9,1.27
TX  (via drill 0.35)
  Top 0.508: JP1.2 3.77,14.3 9.2,14.3 11.1,16.2 v11.1,24.3 | v27.1,23.7 27.1,33.2 v27.2,33.3
  Bottom 0.508: v11.1,24.3 11.7,23.7 v27.1,23.7 | v27.2,33.3 27.2,31.44 U1.35